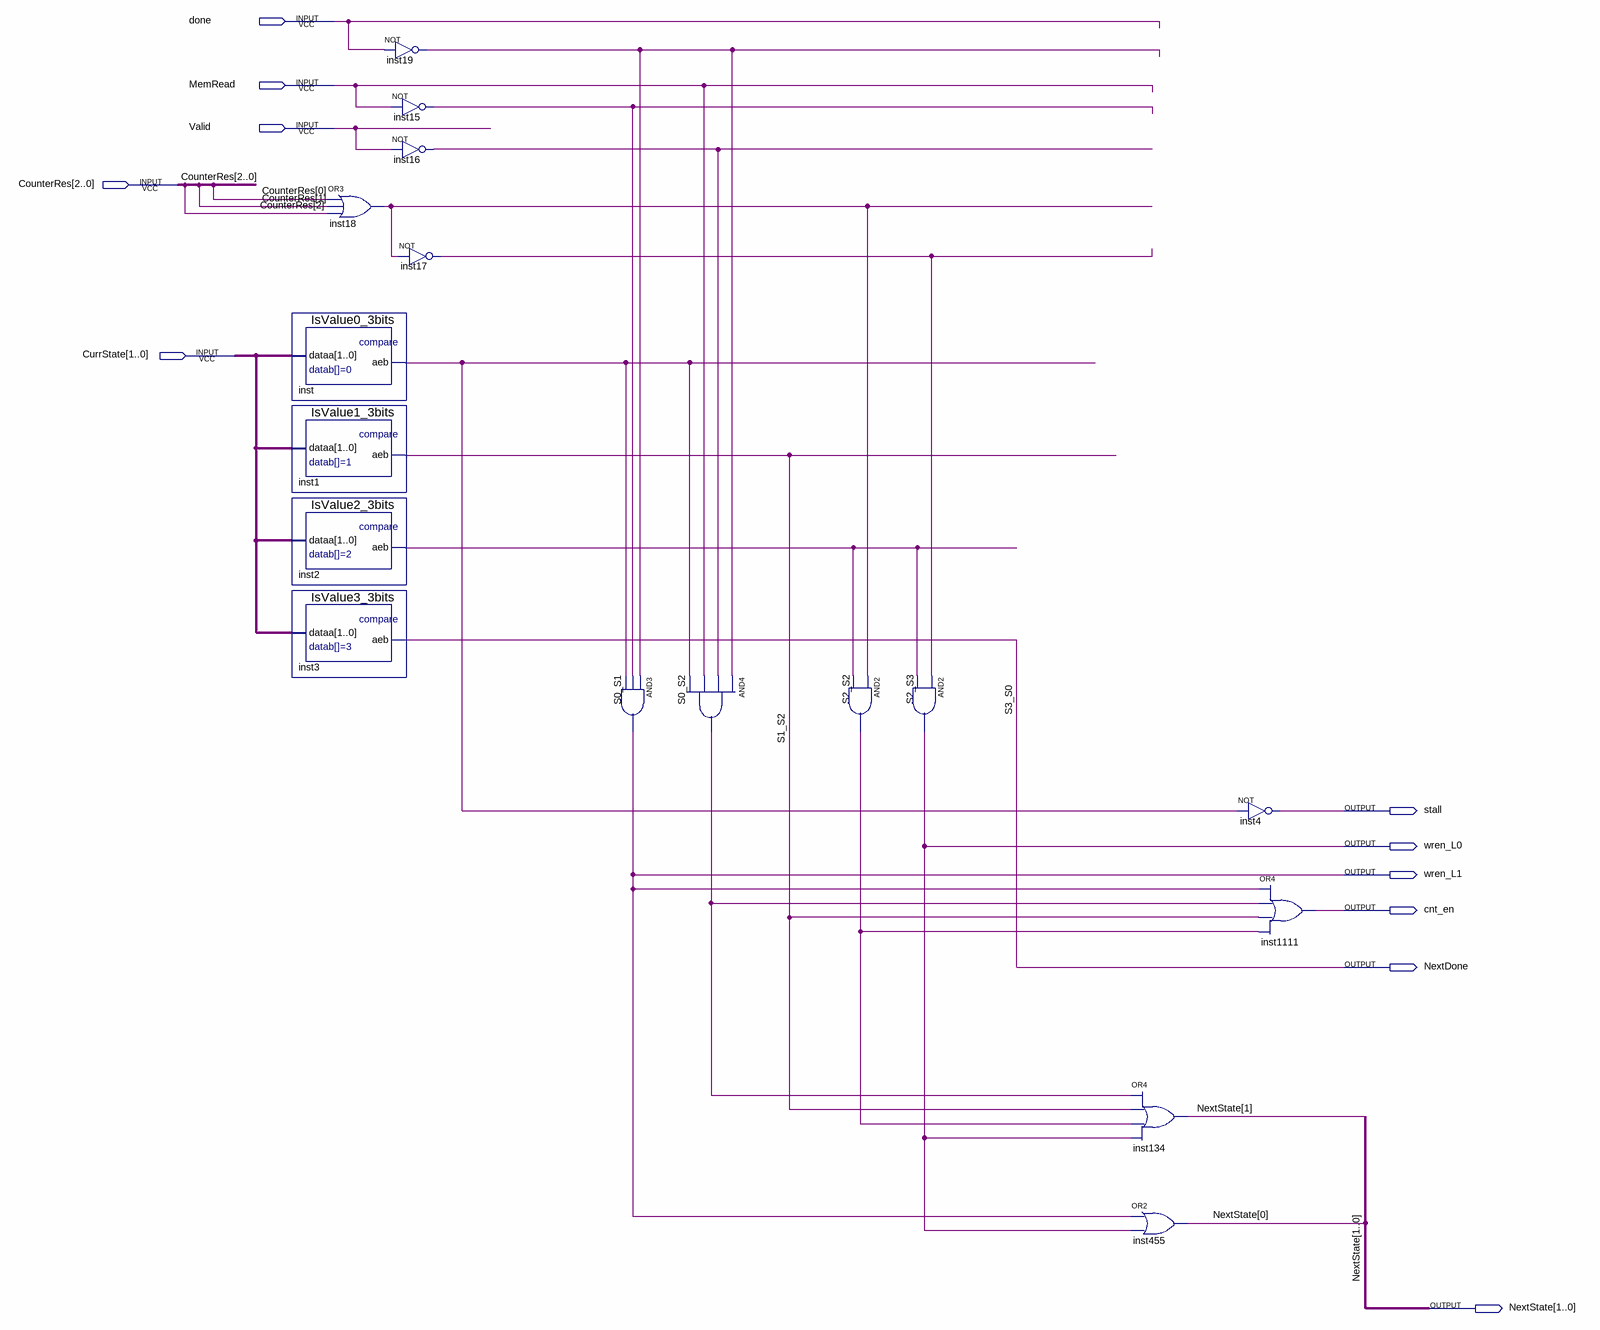
[diagram p0: schematic sheet]
// Quartus schematic MemoryControl.bdf as structural Verilog: 17 symbols, 11 pins
module MemoryControl (
  input  done,
  input  MemRead,
  input  Valid,
  input  [2:0] CounterRes,
  input  [1:0] CurrState,
  output stall,
  output wren_L0,
  output wren_L1,
  output cnt_en,
  output NextDone,
  output [1:0] NextState
);

  wire inst2_aeb, inst15_out, inst16_out, inst17_out, inst18_out, inst19_out, inst_aeb, S0_S2_out, S1_S2,
       S2_S2_out;

  or inst18 (inst18_out, CounterRes[0], CounterRes[1], CounterRes[2]);
  IsValue0_3bits inst (.dataa(CurrState), .aeb(inst_aeb));
  IsValue1_3bits inst1 (.dataa(CurrState), .aeb(S1_S2));
  IsValue2_3bits inst2 (.dataa(CurrState), .aeb(inst2_aeb));
  IsValue3_3bits inst3 (.dataa(CurrState), .aeb(NextDone));
  not inst19 (inst19_out, done);
  not inst15 (inst15_out, MemRead);
  not inst16 (inst16_out, Valid);
  not inst17 (inst17_out, inst18_out);
  and S0_S1 (wren_L1, inst19_out, inst15_out, inst_aeb);
  and S0_S2 (S0_S2_out, inst19_out, inst16_out, MemRead, inst_aeb);
  and S2_S2 (S2_S2_out, inst18_out, inst2_aeb);
  and S2_S3 (wren_L0, inst17_out, inst2_aeb);
  or inst134 (NextState[1], S0_S2_out, S1_S2, S2_S2_out, wren_L0);
  or inst455 (NextState[0], wren_L1, wren_L0);
  not inst4 (stall, inst_aeb);
  or inst1111 (cnt_en, wren_L1, S0_S2_out, S1_S2, S2_S2_out);

  // Other names for the same wires on the sheet: S3_S0 = NextDone
endmodule
